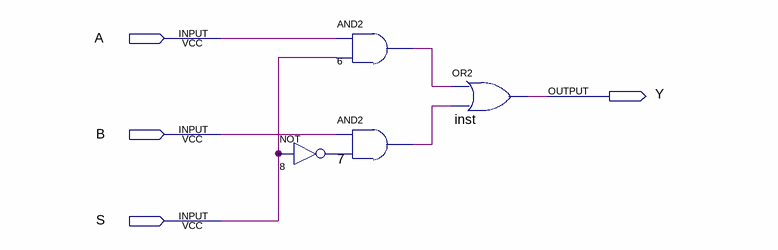
[diagram p0: schematic sheet]
// Quartus schematic MUXA.bdf as structural Verilog: 4 symbols, 4 pins
module MUXA (
  input  A,
  input  B,
  input  S,
  output Y
);

  wire n6_out, n7_out, n8_out;

  not u_8 (n8_out, S);
  and u_6 (n6_out, A, S);
  and u_7 (n7_out, B, n8_out);
  or inst (Y, n6_out, n7_out);
endmodule
